# Altium project TIDA-010042-E2.PrjPcb (part 1 of 3)
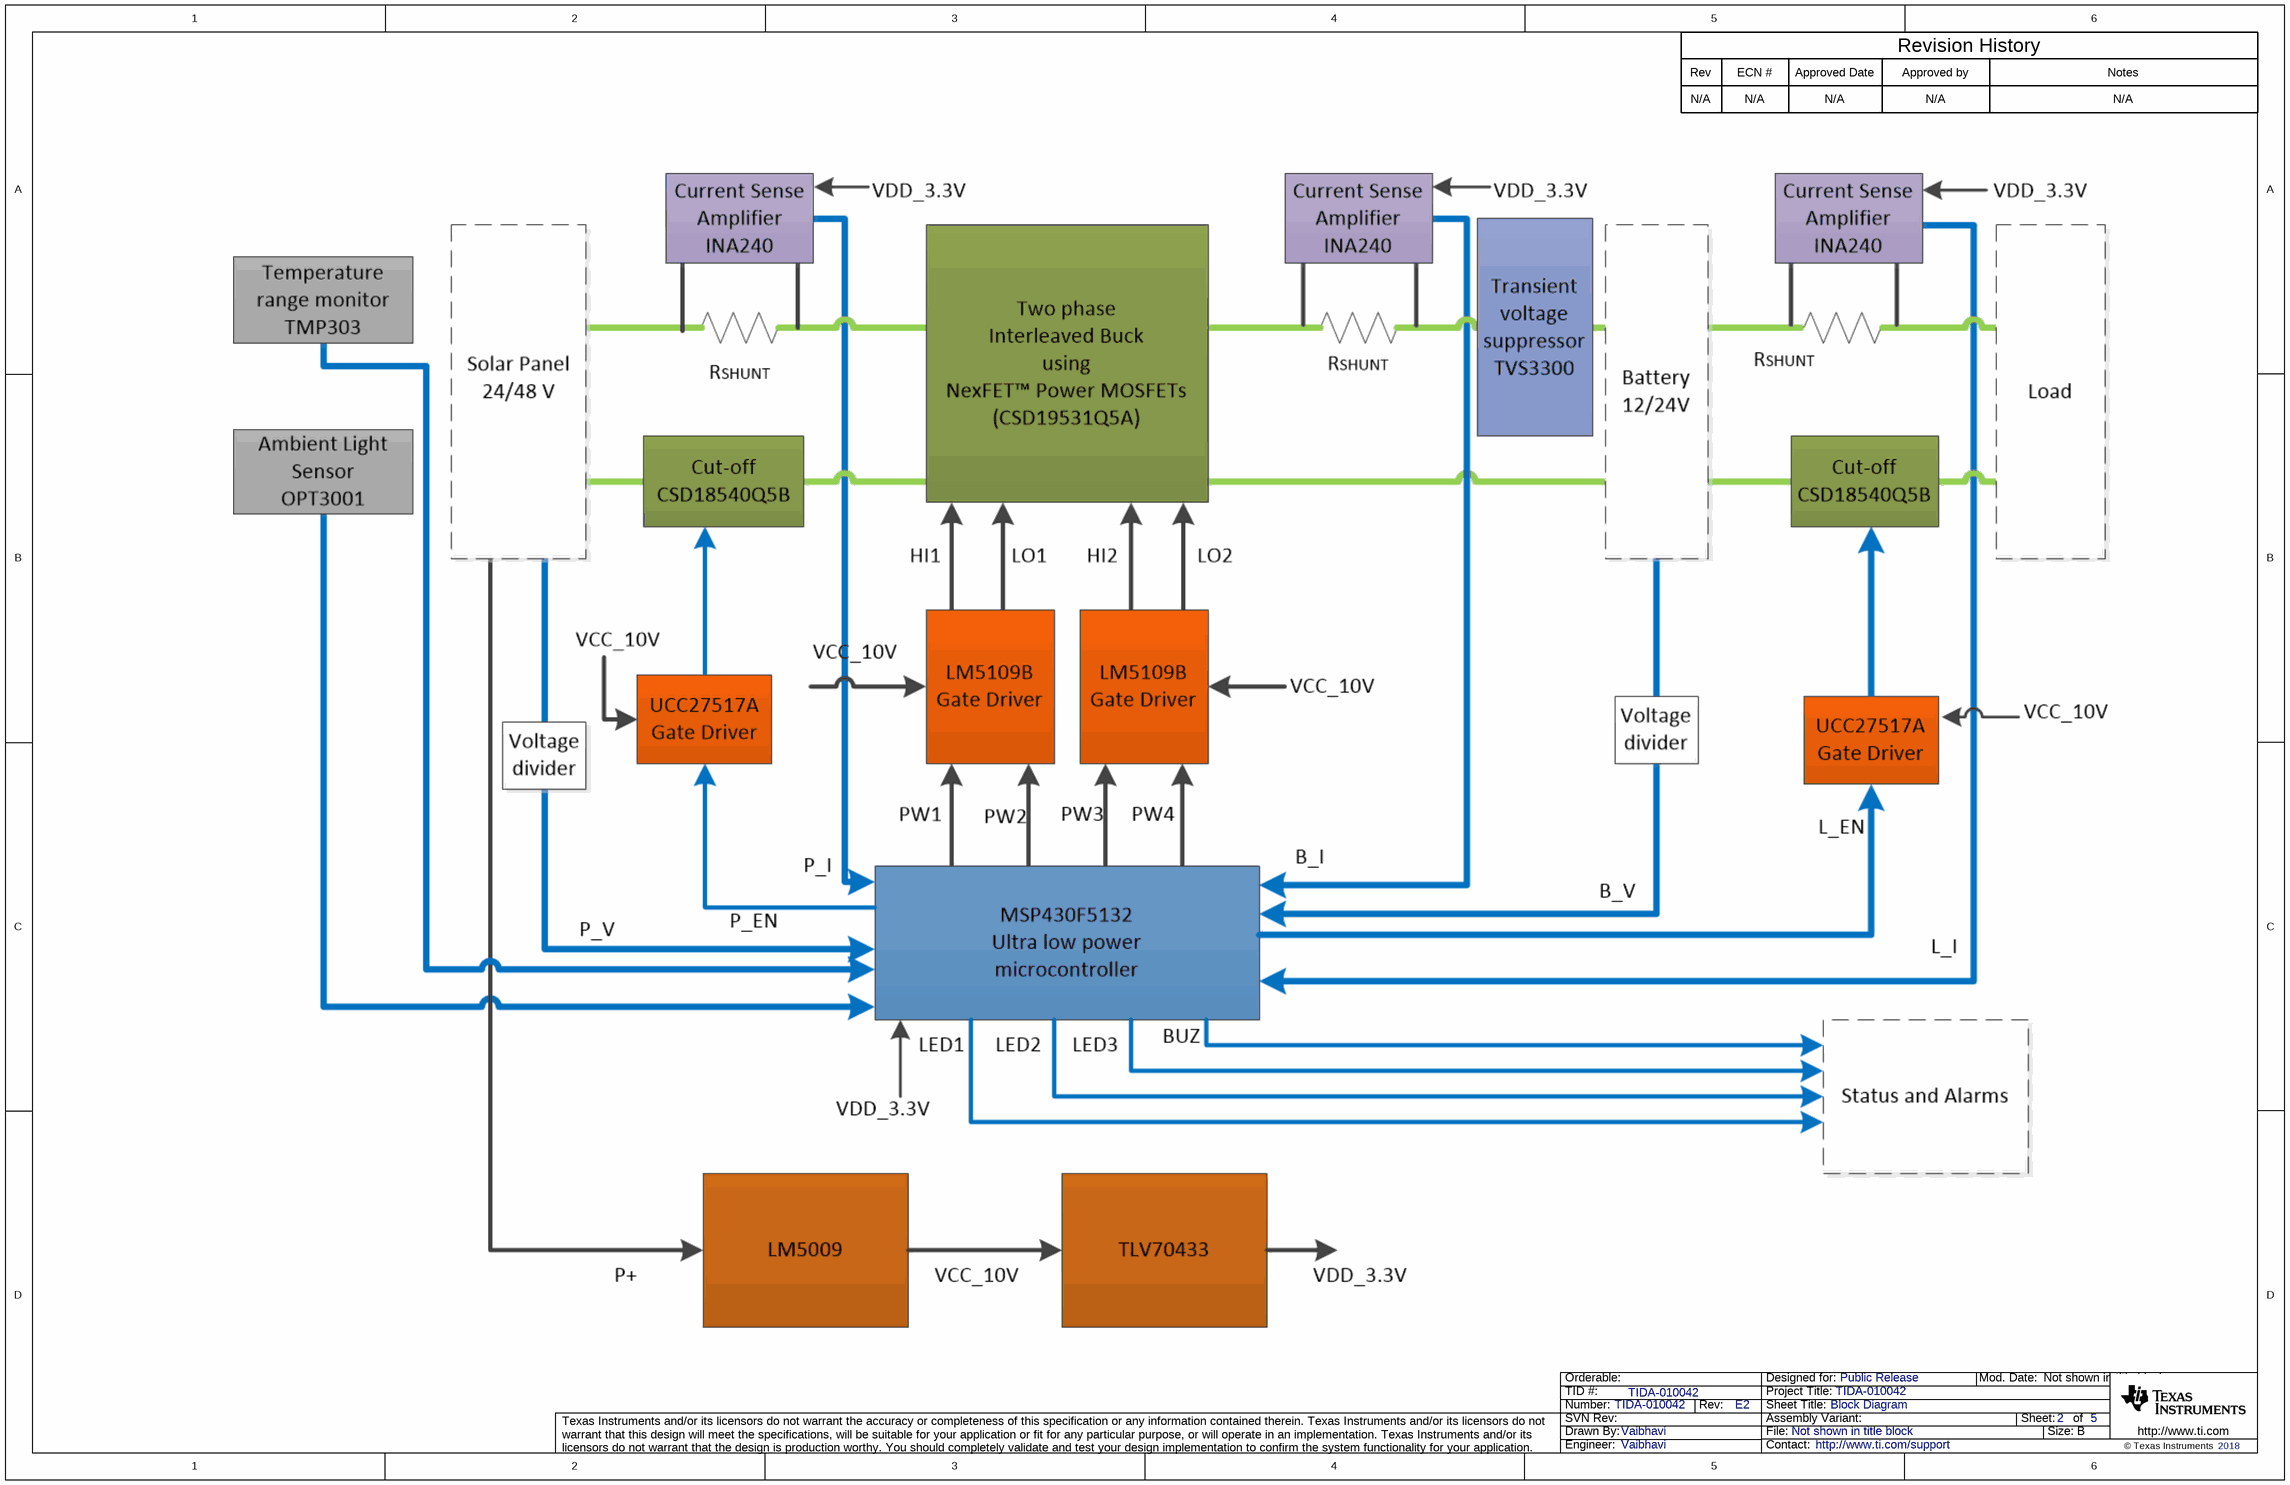
[diagram p0: TIDA-010042-E2_Block Diagram_Pg2.SchDoc]
TID: TIDA-010042; TechSupport: http://www.ti.com/support; SCH_Rev: E2; PRJ_Title: TIDA-010042; PRJ_Number: TIDA-010042; PRJ_Engineer: Vaibhavi; PRJ_Customer: Public Release; PCB_Rev: E2; PCB_Layout: Avinash N; CopyrightYear: 2018; Change in menu Project|Project Options|Parameters: TIDA-010042
5 sheets, 187 parts. Net scope: flat (ports and power ports of the same name join across sheets).
Board file: TIDA-010042-E2_PCB.PcbDoc
Sheets:
  TIDA-010042-E2_Block Diagram_Pg2.SchDoc
  TIDA-010042-E2_Controller and Bias supply_Pg4.SchDoc
  TIDA-010042-E2_Cover Sheet_Pg1.SchDoc
  TIDA-010042-E2_EVM_Hardware_Pg5.SchDoc
  TIDA-010042-E2_Power Stage_Pg3.SchDoc

## Sheet TIDA-010042-E2_Block Diagram_Pg2.SchDoc: Block Diagram
size 431 x 279 mm; Date: Not shown in title block; ApprovedBy: Not shown in title block; CheckedBy: Not shown in title block; Author: Not shown in title block; CompanyName: Not shown in title block; DrawnBy: Vaibhavi; Engineer: Not shown in title block; Organization: Not shown in title block; Address1: Not shown in title block; Address2: Not shown in title block; Address3: Not shown in title block; Address4: Not shown in title block; DocumentNumber: 1; Revision: Use project parameter SCH_Rev; SheetNumber: 2; SheetTotal: 5; PageSetup: Record=PageOptions|CenterHorizontal=True|CenterVertical=True|PrintScale=1.00|XCorrection=1.00|YCorrection=1.00|PrintKind=0|BorderSize=5000000|LeftOffset=0|BottomOffset=0|Orientation=2|PaperLength=1000|PaperWidth=1000|Scale=100|PaperSource=15|PrintQuality=600|MediaType=1|DitherType=10|PaperKind=Letter|PrintScaleMode=1; CurrentTime: Not shown in title block; CurrentDate: Not shown in title block; Time: Not shown in title block; DocumentFullPathAndName: Not shown in title block; DocumentName: Not shown in title block; ModifiedDate: Not shown in title block; ImagePath: Not shown in title block

### Notes on the sheet
- Rev
- N/A
- ECN #
- Approved Date
- Approved by
- Revision History
- Notes
- Drawn By:
- SVN Rev:
- Number:
- TID #:
- Orderable:
- Rev:
- Sheet Title:
- File:
- Project Title:
- Designed for:
- Assembly Variant:
- Mod. Date:
- Sheet:
- Size:
- of
- B
- http://www.ti.com
- Texas Instruments and/or its licensors do not warrant the accuracy or completeness of this specification or any information contained therein. Texas Instruments and/or its licensors do not warrant that this design will meet the specifications, will be suitable for your application or fit for any particular purpose, or will operate in an implementation. Texas Instruments and/or its licensors do not warrant that the design is production worthy. You should completely validate and test your design implementation to confirm the system functionality for your application.
- Engineer:
- Contact:
- © Texas Instruments